# EAGLE design B4_FM_+X_SOLAR_PANEL_v2 (EAGLE 9.2.0)
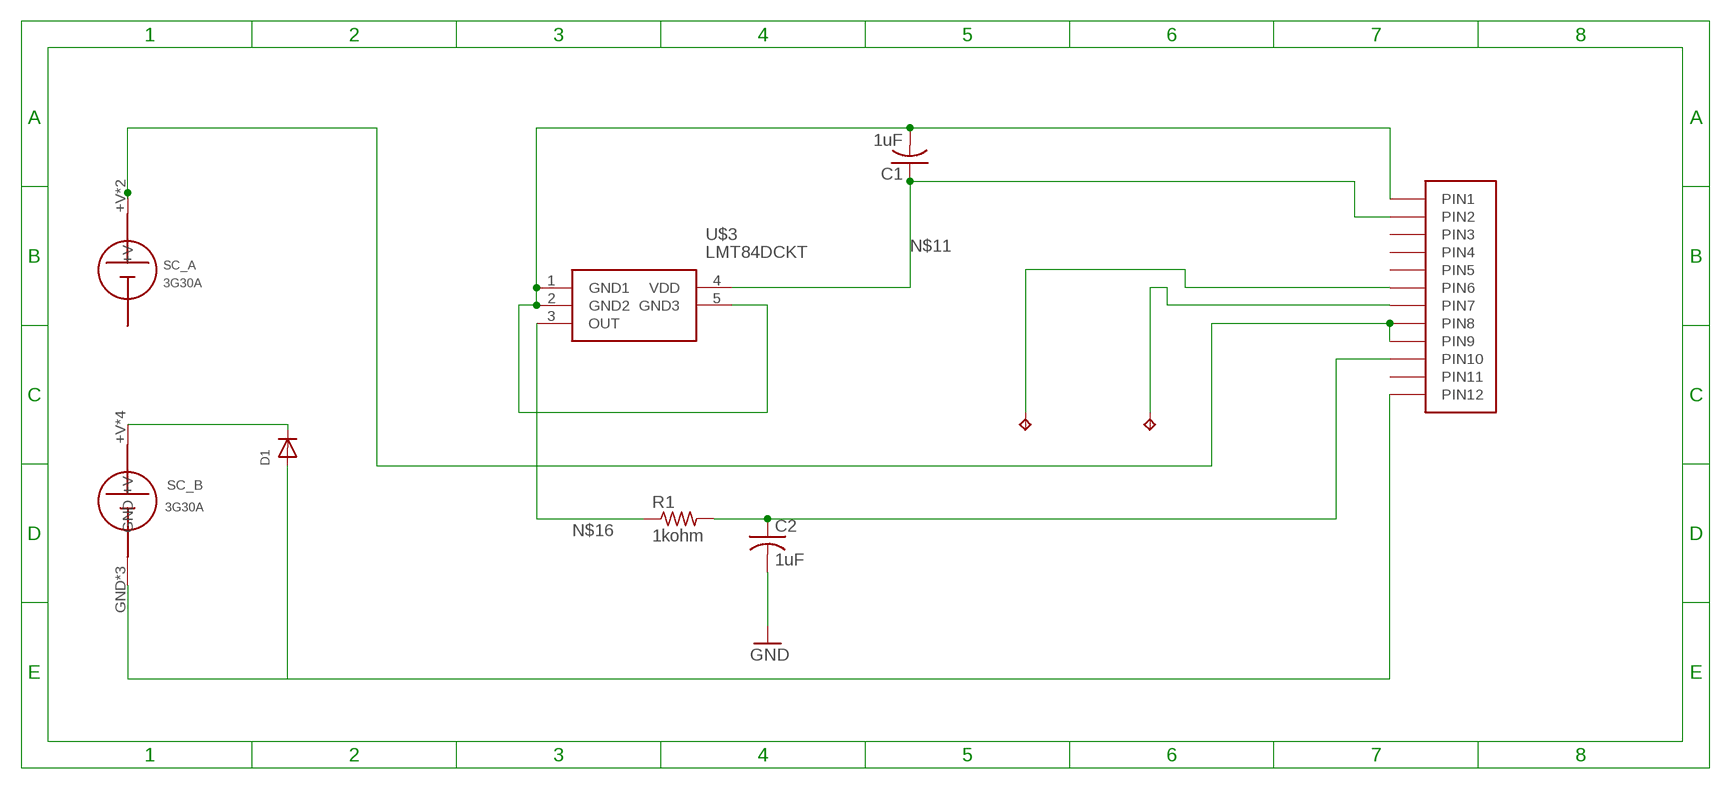
[diagram p0: schematic, sheet 1]

## Parts
C1  1uF  C-USC0805  [C0805]
C2  1uF  C-USC0805  [C0805]
D1  DIODE_SOD-123FL  [SOD-123FL]
R1  1kohm  R-US_R0402  [R0402]
SDA1  S1751-46R  [S1751-46R]
SDA3  S1751-46R  [S1751-46R]
SOLARCELL_A  SC_A  [SC_A]
SOLARCELL_B  SC_B  [SC_B]
U$1  HEADER12PIN  [HEADER12PIN]
U$3  LMT84DCKT  [SOT65P210X110-5N]

## Nets
+V: SOLARCELL_A.+V SOLARCELL_A.+V1(+V) U$1.P8(PIN8) U$1.P9(PIN9)
+VB: D1.C SOLARCELL_B.+V SOLARCELL_B.+V2(+V) SOLARCELL_B.+V3(+V) SOLARCELL_B.+V4(+V)
GND: C1.2 C2.2 D1.A SOLARCELL_B.GND SOLARCELL_B.GND1(GND) SOLARCELL_B.GND2(GND) U$1.P1(PIN1) U$1.P12(PIN12) U$3.1(GND1) U$3.2(GND2) U$3.5(GND3)
N$2: SDA1.P$1(TP) U$1.P6(PIN6)
N$11: C1.1 U$1.P2(PIN2) U$3.4(VDD)
N$15: SDA3.P$1(TP) U$1.P7(PIN7)
N$16: R1.1 U$3.3(OUT)
N$19: C2.1 R1.2 U$1.P10(PIN10)
Unconnected: U$1.P3(PIN3) U$1.P4(PIN4) U$1.P5(PIN5) U$1.P11(PIN11)

## Library data of the parts
C1 C2 = adafruit:C-US: CAPACITOR, American symbol
D1 = adafruit:DIODE: Diode SMADIODE - SMA Surface Mount Package 20V 1A Schottky Diode Digikey: 641-1014-6-ND DO-1N4148 - Through Hole Small Current Diode SOD-123 20V 1 A (.5mV Vf) Schottky Diode - Digikey: MBRX120TPMSCT-ND SOD-323 10V 570mA (.38mV Vf, 3ns) Schottky Diode - Digikey: ZLLS410CT-ND SOD-523 30V 30mA Schottky Diode (RB751S-40TE61) - Digikey: RB751S-40TE61CT-ND SOT23-R/W - SOT23 Package (R = Solder Paste/Reflow Ovens, W = Hand-Soldering) BAT54Film 40V 300mA - Digikey: 497-7162-1-ND
R1 = adafruit:R-US_: RESISTOR, American symbol
SDA1 SDA3 = BIRDS3_MSN_BRD_II:S1751-46R
SOLARCELL_A = SC_A:SC_A
SOLARCELL_B = SC_B-2:SC_B
U$1 = BIRDS:HEADER12PIN
U$3 = LMT84DCKT:LMT84DCKT: 1.5V-Capable, 10 uA Analog Output Temperature Sensor in SC70 and TO-92 Source: Datasheet <http://uk.rs-online.com/web/p/products/8115860>; DESCRIPTION: 1.5V-Capable, 10 uA Analog Output Temperature Sensor in SC70 and TO-92; HEIGHT: 1.1mm; MANUFACTURER_NAME: Texas Instruments; MANUFACTURER_PART_NUMBER: LMT84DCKT; RS_PART_NUMBER: 8115860

## Board
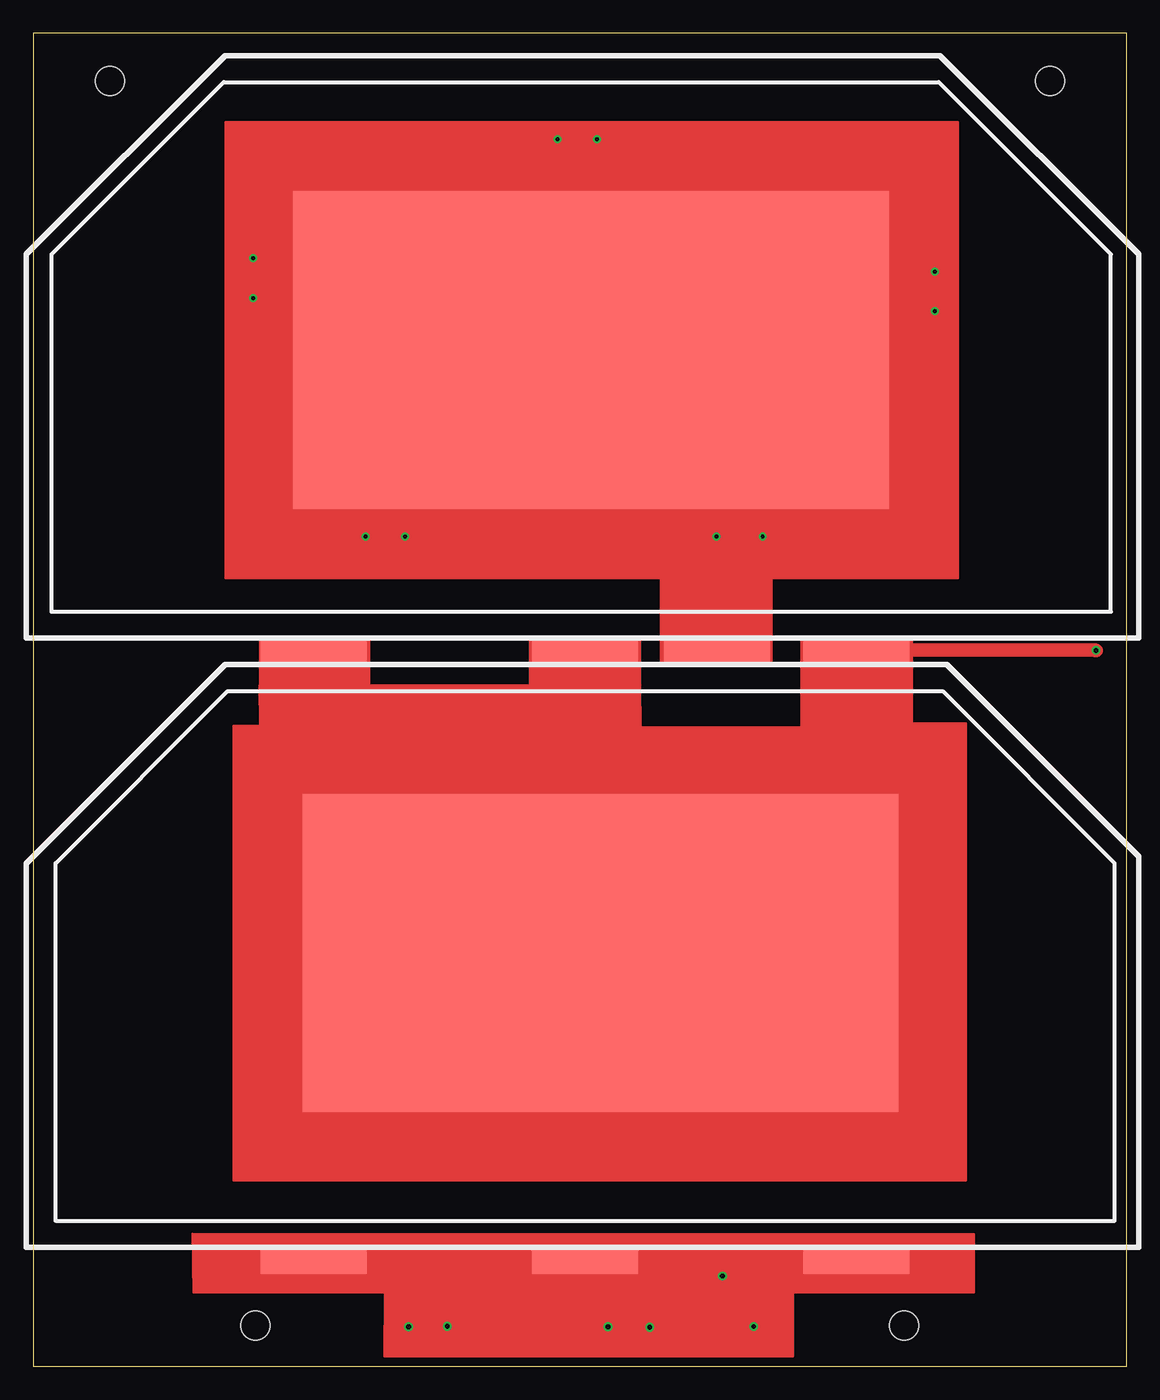
[diagram p1: board, top side]
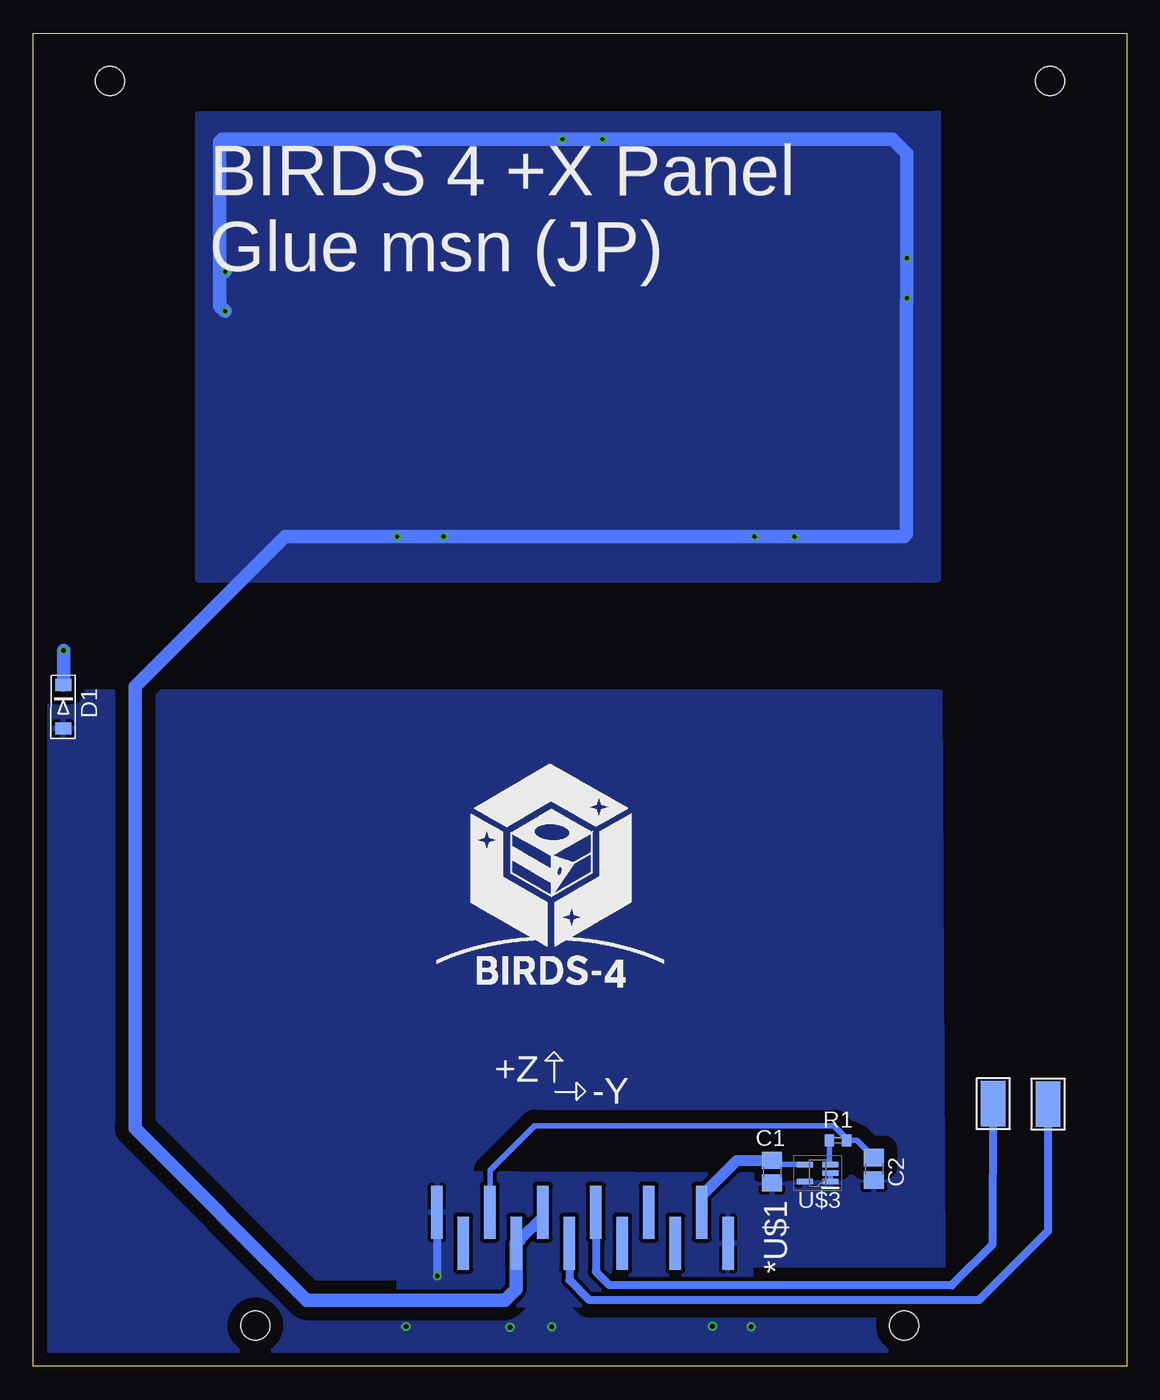
[diagram p2: board, bottom side, seen from below]

Size 82.6 x 100.7 mm. Coordinates in mm from the lower left corner, seen from the top.
Outline: 0,0 82.6,0 82.6,100.7 0,100.7 0,0
Copper layers (1*16): Top 0.035mm / dielectric 1.53mm / Bottom 0.035mm
Design rules "pban_5mil-l2 *": minimum track width 5mil, minimum drill 0.3mm, track to track 5mil, track to pad 0.229mm, pad to pad 5mil, via to via 5mil, smd to smd 5mil, copper to edge 0.5mm, drill to drill 0.5mm, minimum pad ring 0.15mm, minimum via ring 0.15mm, stop-mask expansion 4mil, vias tented up to drill 0.3mm, thermal gap 10mil
Holes 2.2 mm at 16.8,3.1 65.8,3.1 5.8,97.1 76.8,97.1

### Footprints (pad centres in the part's own frame; a part is rotated, then mirrored left to right if it is on the bottom)
C0805 = smd 1.3 x 1.5: 1 -0.85,0; 2 0.85,0
SOD-123FL = smd 0.91 x 1.22 bottom: A 1.637,0; C -1.637,0
R0402 = smd 0.7 x 0.9: 1 -0.65,0; 2 0.65,0
S1751-46R = smd 3.45 x 1.85: P$1 0,0
SC_A = smd 45 x 24: +V 40.75,19.75 | smd 8 x 2: +V1 50.25,-3
SC_B = smd 45 x 24: +V 41.14,20.22 | smd 8 x 2: +V2 19.5,43; +V3 40,43; +V4 60.5,43; GND 60.5,-3; GND1 19.5,-3; GND2 40,-3
HEADER12PIN = smd 4 x 0.89: P1 0,0; P2 2.35,2; P3 0,4; P4 2.35,6; P5 0,8; P6 2.35,10; P7 0,12; P8 2.35,14; P9 0,16; P10 2.35,18; P11 0,20; P12 2.35,22
SOT65P210X110-5N = smd 1.2 x 0.4: 1 -0.95,0.65; 2 -0.95,0; 3 -0.95,-0.65; 4 0.95,-0.65; 5 0.95,0.65

### Placement (x,y rotation side)
C1  26.78,14.71 270 bottom
C2  19.08,14.92 270 bottom
D1  80.32,49.82 270 top
R1  21.81,17.07 0 bottom
SDA1  10.08,19.84 90 bottom
SDA3  5.94,19.81 270 bottom
SOLARCELL_A  1.4,57 0 top
SOLARCELL_B  1.7,11 0 top
U$1  30.1,9.3 90 bottom
U$3  23.34,14.6 180 bottom

### Tracks (layer width: path | path; a pad name or v marks a point on that pad's centre or on a via)
+V  (via drill 0.3)
  Top 1.016: v51.61,62.69 51.61,54.04 SOLARCELL_A.+V1 | v42.61,92.69 42.61,77.21 SOLARCELL_A.+V
  Bottom 0.813: U$1.P9 45.89,9.51 44.1,11.3 U$1.P8
  Bottom 1.016: v42.61,92.69 42,92.69 | v42.61,92.69 68.31,92.69 68.5,92.5 68.5,83.08 | 68.5,83.08 v68.11,82.69 | 68.5,83.08 68.5,80.08 v68.11,79.69 | v42.61,92.69 v39.61,92.69 17.69,92.69 16.61,91.61 v16.61,83.69 16.61,80.39 | 16.63,80.46 16.63,62.87 16.81,62.69 v28.11,62.69 v51.61,62.69 v55.11,62.69 63.57,62.69 74.91,51.36 74.91,17.98 61.92,5 46.94,5 46.13,5.82 46.13,9.27 45.89,9.51
  other vias: 25.11,62.69 16.61,80.69
  pour Bottom (isolate 0.305): 14.4,94.5 70.1,94.5 70.1,59.5 14.3,59.5 14.3,94.7
+VB  (via drill 0.35)
  Top 0.406: SOLARCELL_B.+V2 21.2,44.4 21.93,43.67 31.37,43.67 SOLARCELL_B.+V3 41.76,53.94 44.53,53.94 44.53,44.05 44.68,43.9 | 44.68,43.9 59.72,43.9 61.89,46.07 61.89,53.69 SOLARCELL_B.+V4 | 44.68,43.9 44.68,33.06 SOLARCELL_B.+V
  Top 1.016: SOLARCELL_B.+V4 62.3,54.1 80.22,54.1 80.25,54.07 v80.29,54.07
  Bottom 1.016: v80.29,54.07 80.29,51.48 D1.C
GND  (via drill 0.35)
  Top 0.406: v31.29,3.03 26.32,8 SOLARCELL_B.GND1 | v46.58,2.96 40.08,6.38 SOLARCELL_B.GND2 | SOLARCELL_B.GND 55.65,8 52.07,4.42 v52.07,6.81
  Bottom 0.406: U$3.2 U$3.1
  Bottom 0.61: U$1.P12 52.1,6.83 v52.07,6.81
  other vias: 28.36,3 43.42,3 54.43,3.02
  pour Bottom (isolate 1): 14.1,50.92 81.8,50.92 81.56,1.12 13.86,1.12
  pour Bottom (isolate 0.305): 28.21,14.5 54.82,14.62 54.82,13.71 55.06,4.53 48.01,4.62 32.72,4.62 28.35,6.61
N$2
  Bottom 0.61: U$1.P6 40.1,7.16 39.09,6.15 13.21,6.15 | 13.21,6.15 13.18,6.12 | SDA1.P$1 10.13,9.23 13.21,6.15
N$11
  Bottom 0.406: C1.1 26.48,15.25 U$3.4
  Bottom 0.813: C1.1 29.44,15.56 32.1,12.9 U$1.P2
N$15
  Bottom 0.61: U$1.P7 42.1,6.54 40.56,5 11.15,5 5.94,10.21 5.94,11.58 5.94,12.14 SDA3.P$1
N$16
  Bottom 0.406: U$3.3 22.46,15.31 R1.1
N$19
  Bottom 0.406: C2.1 20.39,17.07 R1.2 21.16,17.24 22.1,18.18 44.72,18.18 48.1,14.8 U$1.P10

### Text on the board
bPlace: BIRDS 4 +X Panel / Glue msn (JP) | +Z | -Y
bNames: *U$1